# Altium schematic sheet Block Diagram.SchDoc
size A3; ApprovedBy: M. Berk Aydoğan; CheckedBy: Udemy; Revision: AA; SheetNumber: 2; SheetTotal: 2; PageSize: A3; ProjectDescription: Wireless Security Detector; PreparedBy: Elif Arslan
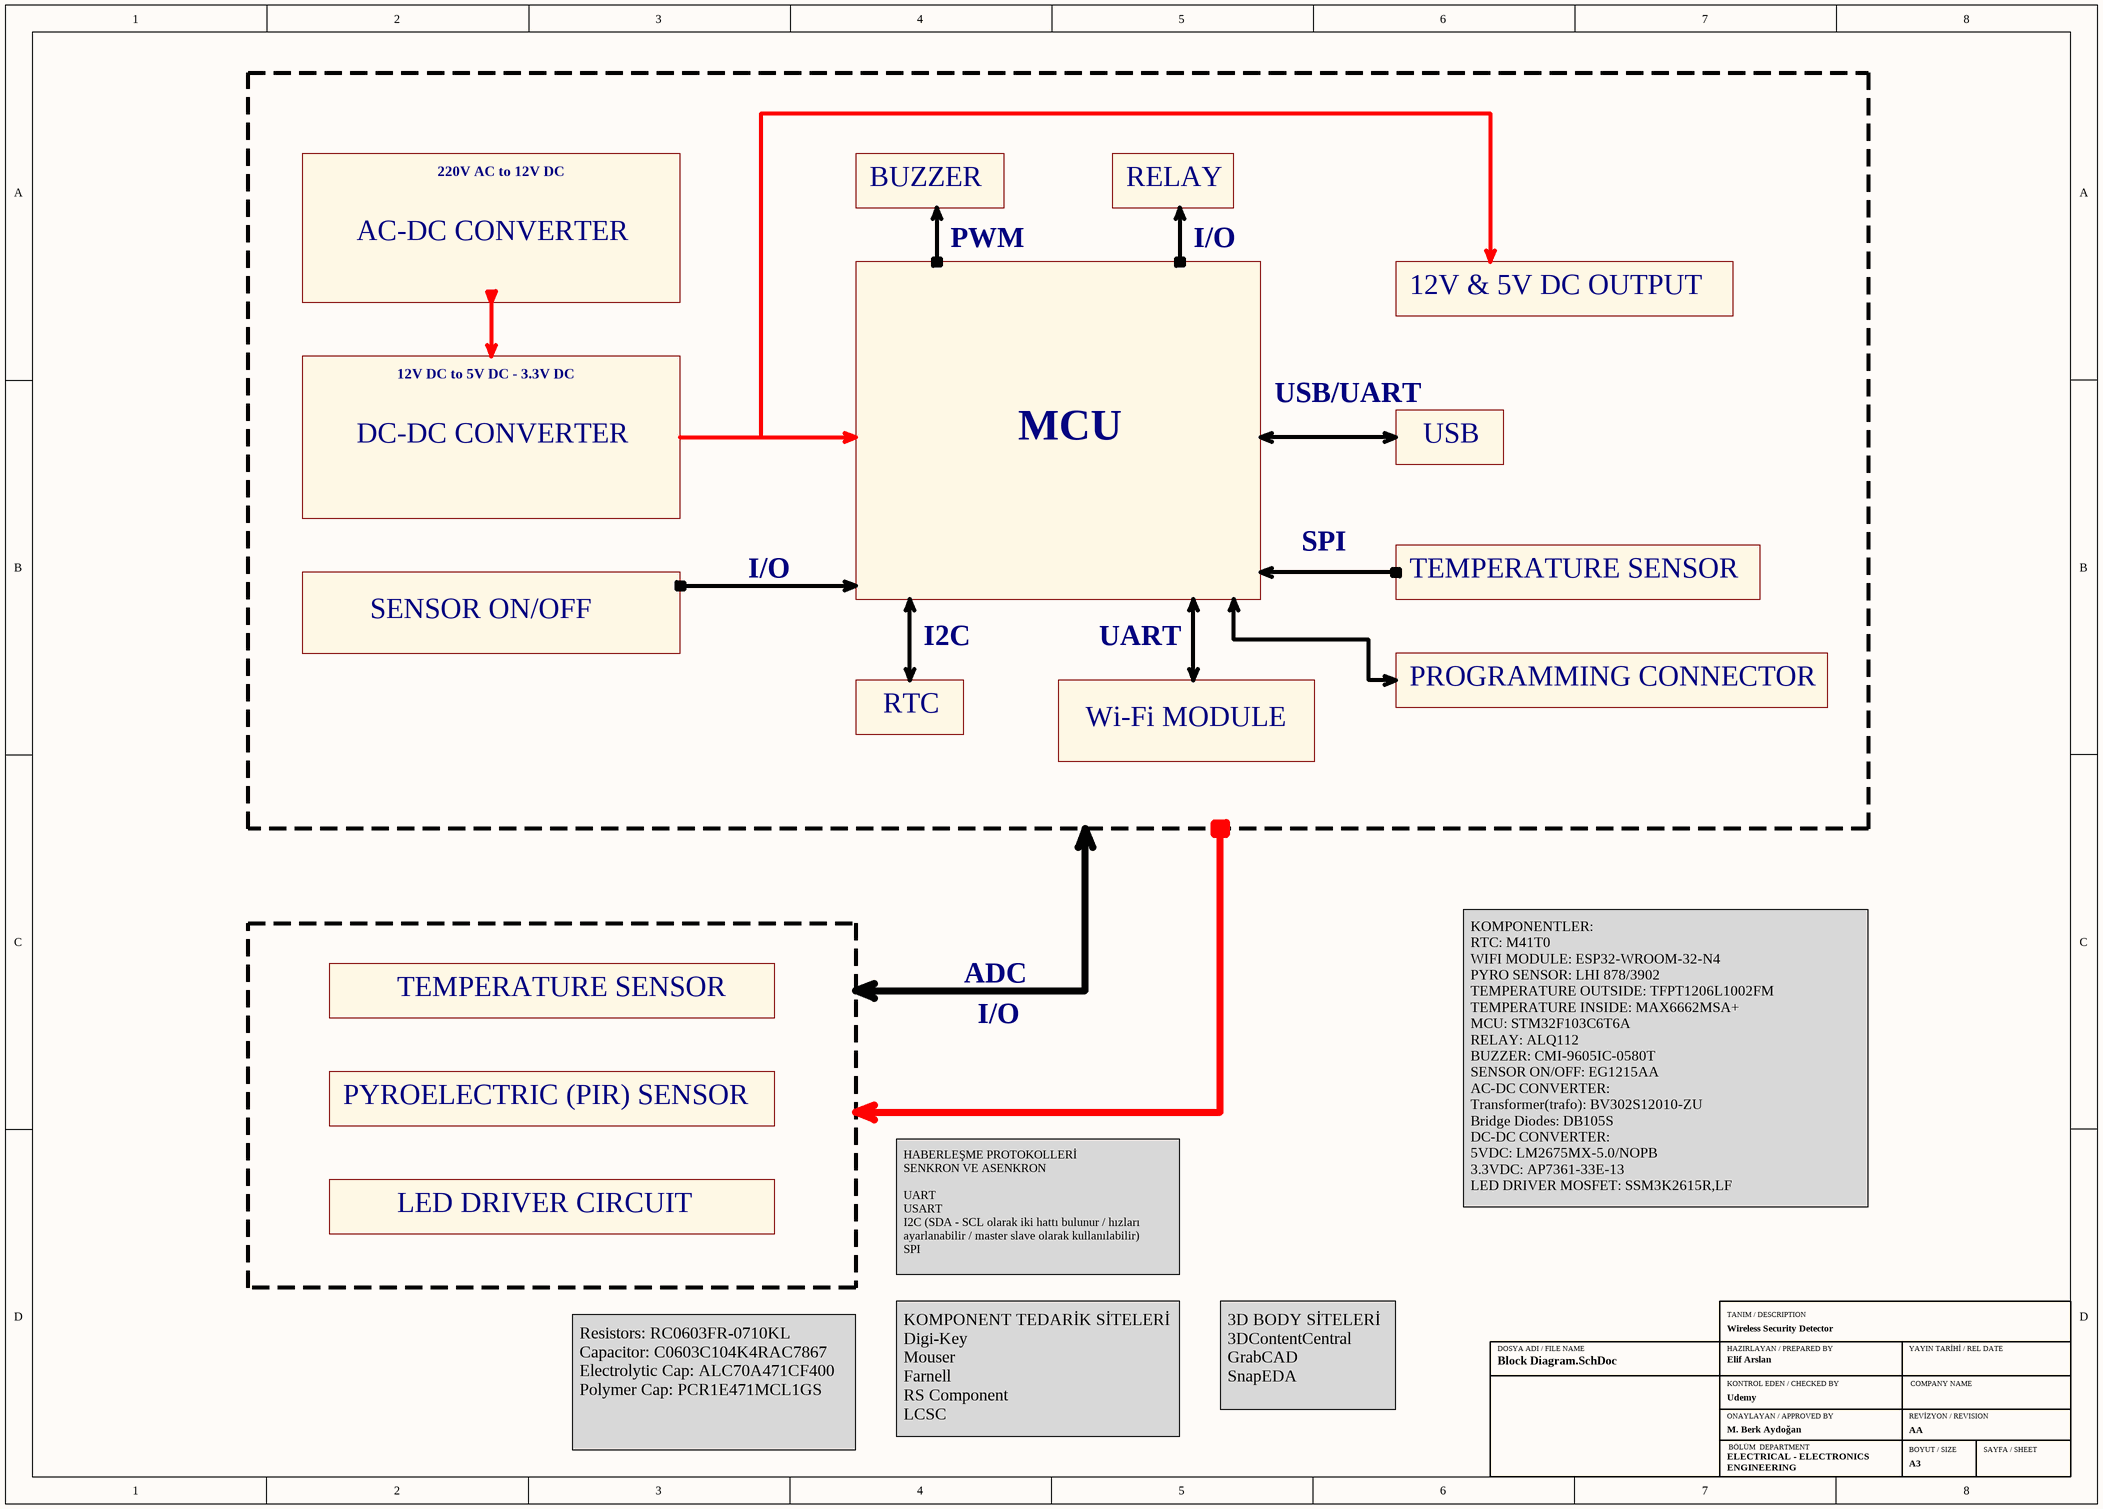
[diagram p0: Block Diagram.SchDoc]

## Notes on the sheet
- 220V AC to 12V DC
- AC-DC CONVERTER
- BUZZER
- RELAY
- PWM
- I/O
- 12V & 5V DC OUTPUT
- 12V DC to 5V DC - 3.3V DC
- DC-DC CONVERTER
- MCU
- USB/UART
- USB
- SPI
- TEMPERATURE SENSOR
- SENSOR ON/OFF
- I2C
- UART
- RTC
- PROGRAMMING CONNECTOR
- Wi-Fi MODULE
- ADC
- PYROELECTRIC (PIR) SENSOR
- LED DRIVER CIRCUIT
- KOMPONENTLER:
  RTC: M41T0
  WIFI MODULE: ESP32-WROOM-32-N4
  PYRO SENSOR: LHI 878/3902
  TEMPERATURE OUTSIDE: TFPT1206L1002FM
  TEMPERATURE INSIDE: MAX6662MSA+
  MCU: STM32F103C6T6A
  RELAY: ALQ112
  BUZZER: CMI-9605IC-0580T
  SENSOR ON/OFF: EG1215AA
  AC-DC CONVERTER:
  Transformer(trafo): BV302S12010-ZU
  Bridge Diodes: DB105S
  DC-DC CONVERTER:
  5VDC: LM2675MX-5.0/NOPB
  3.3VDC: AP7361-33E-13
  LED DRIVER MOSFET: SSM3K2615R,LF
- HABERLEŞME PROTOKOLLERİ
  SENKRON VE ASENKRON
  UART
  USART
  I2C (SDA - SCL olarak iki hattı bulunur / hızları ayarlanabilir / master slave olarak kullanılabilir)
  SPI
- Resistors: RC0603FR-0710KL
  Capacitor: C0603C104K4RAC7867
  Electrolytic Cap: ALC70A471CF400
  Polymer Cap: PCR1E471MCL1GS
- KOMPONENT TEDARİK SİTELERİ
  Digi-Key
  Mouser
  Farnell
  RS Component
  LCSC
- 3D BODY SİTELERİ
  3DContentCentral
  GrabCAD
  SnapEDA
- TANIM / DESCRIPTION
- DOSYA ADI / FILE NAME
- HAZIRLAYAN / PREPARED BY
- KONTROL EDEN / CHECKED BY
- YAYIN TARİHİ / REL DATE
- COMPANY NAME
- ONAYLAYAN / APPROVED BY
- ELECTRICAL - ELECTRONICS
- BÖLÜM  DEPARTMENT
- BOYUT / SIZE
- REVİZYON / REVISION
- SAYFA / SHEET
- ENGINEERING